# Altium schematic sheet 键盘4x4.SchDoc: 4X4键盘
size A4; DrawnBy: Athurg; DocumentNumber: 1; SheetNumber: 1
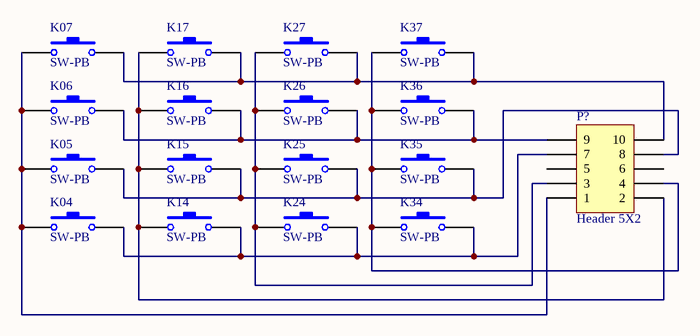
[diagram p0: 键盘4x4.SchDoc]

## Parts
K04  SW-PB  [SPST-2]
K05  SW-PB  [SPST-2]
K06  SW-PB  [SPST-2]
K07  SW-PB  [SPST-2]
K14  SW-PB  [SPST-2]
K15  SW-PB  [SPST-2]
K16  SW-PB  [SPST-2]
K17  SW-PB  [SPST-2]
K24  SW-PB  [SPST-2]
K25  SW-PB  [SPST-2]
K26  SW-PB  [SPST-2]
K27  SW-PB  [SPST-2]
K34  SW-PB  [SPST-2]
K35  SW-PB  [SPST-2]
K36  SW-PB  [SPST-2]
K37  SW-PB  [SPST-2]
P?  Header 5X2  [HDR2X5]

## Nets
NetK04_1: K04.1 K05.1 K06.1 K07.1 P?.1
NetK04_2: K04.2 K14.2 K24.2 K34.2 P?.7
NetK05_2: K05.2 K15.2 K25.2 K35.2 P?.8
NetK06_2: K06.2 K16.2 K26.2 K36.2 P?.9
NetK07_2: K07.2 K17.2 K27.2 K37.2 P?.10
NetK14_1: K14.1 K15.1 K16.1 K17.1 P?.2
NetK24_1: K24.1 K25.1 K26.1 K27.1 P?.3
NetK34_1: K34.1 K35.1 K36.1 K37.1 P?.4

Not connected (* = marked no-connect by the designer): P? 5 6

## Library data of the parts
K04 K05 K06 K07 K14-K17 K24-K27 K34-K37 = SW-PB: Switch; Published: 24-Mar-1999; LatestRevisionDate: 17-Jul-2002; LatestRevisionNote: Re-released for DXP Platform.; PackageReference: SPST-2; Publisher: Altium Limited
P? = Header 5X2: Header, 5-Pin, Dual row; LatestRevisionDate: 17-Jul-2002; LatestRevisionNote: Re-released for DXP Platform.; Publisher: Altium Limited